# Altium schematic sheet FOC_Drv_1.SchDoc
size A4; SheetNumber: 1; SheetTotal: 1; SPICEModelCacheWCPWHGOG: <root> / <DocumentId>WCPWHGOG</DocumentId> / <CacheFrame Number="0"> / <Model Name="skydiode" Kind="MDL"> / <Text>*Default Schottky Diode / *Schottky Diode Pinout: A,K / .MODEL SKYDIODE D(EG=0.69 XTI=2)</Text> / </Model> / <Model Name="10tq040" Kind="MDL"> / <Text>*10TQ040 MCE 3/26/98 / *Ref: IR Power Semiconductors Product Digest '94 / *MCE 40V 10A 3us pkg:TO-220 3,1 / .MODEL 10TQ040 D (IS=14.2N RS=4.2M N=1.7 BV=40 IBV=15M / + CJO=412P VJ=0.75 M=0.333 TT=4.32U EG=.69 XTI=2)</Text> / </Model> / <Model Name="pnp" Kind="MDL"> / <Text>*Default PNP BJT / *PNP Trans Pinout: C,B,E / .MODEL PNP PNP()</Text> / </Model> / </CacheFrame> / </root>
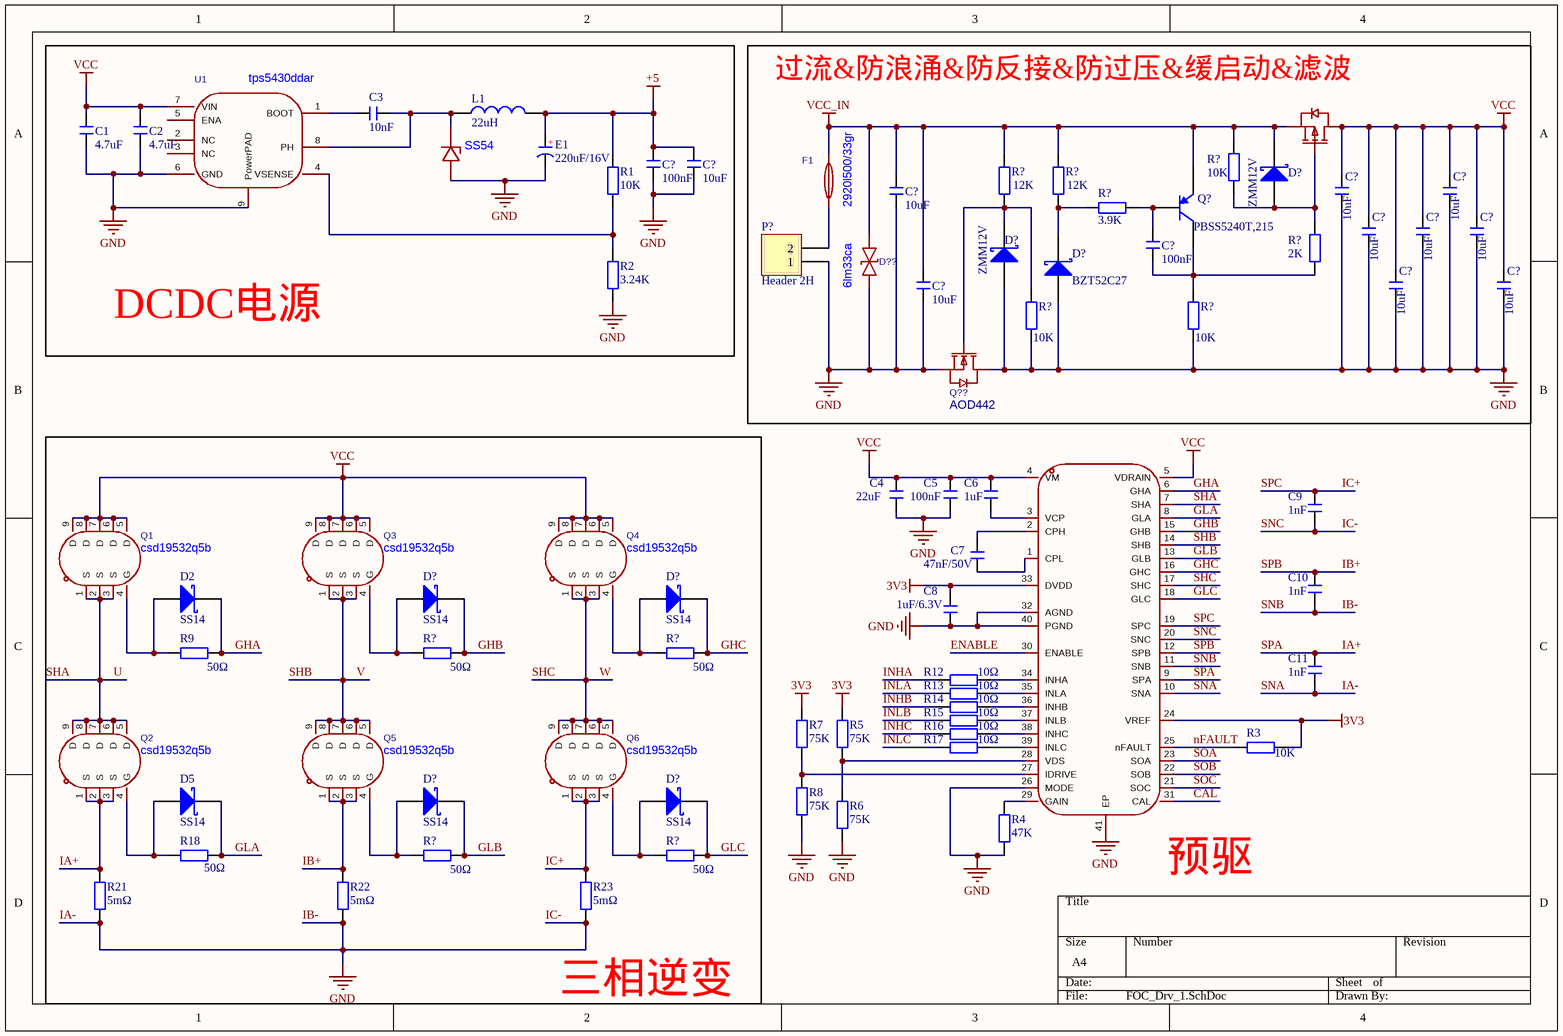
[diagram p0: FOC_Drv_1.SchDoc]

## Parts
(Parts that share a designator on the sheet are numbered #1, #2 ... from top to bottom, then left to right.)
C1  4.7uF  [C 0805]
C2  4.7uF  [C 0805]
C3  10nF  [C 0805]
C4  22uF  [C 0805]
C5  100nF  [C 0805]
C6  1uF  [C 0805]
C7  47nF/50V  [C 0805]
C8  1uF/6.3V  [C 0805]
C9  1nF  [C 0805]
C10  1nF  [C 0805]
C11  1nF  [C 0805]
C?#1  100nF  [C 0805]
C?#2  10uF  [C 0805]
C?#3  10uF  [C 0805]
C?#4  10uF  [C 0805]
C?#5  10uF  [C 0805]
C?#6  10uF  [C 0805]
C?#7  10uF  [C 0805]
C?#8  10uF  [C 0805]
C?#9  100nF  [C 0805]
C?#10  10uF  [C 0805]
C?#11  10uF  [C 0805]
C?#12  10uF  [C 0805]
D1  SS54  [SMA_L4.3-W2.6-LS5.0-FD]
D2  SS14  [SMB]
D5  SS14  [SMB]
D?#1  ZMM12V  [TO-220AC]
D?#2  ZMM12V  [TO-220AC]
D?#3  BZT52C27  [TO-220AC]
D?#4  SS14  [SMB]
D?#5  SS14  [SMB]
D?#6  SS14  [SMB]
D?#7  SS14  [SMB]
D??  6lm33ca  [6LM33CA]
E1  220uF/16V  [CM A(3*5.4)]
F1  2920l500/33gr  [2920l500/33gr]
L1  22uH  [L 0805]
P?  Header 2H  [HDR1X2H]
Q1  csd19532q5b  [SON-8_L5.0-W6.0-P1.27-BL-1]
Q2  csd19532q5b  [SON-8_L5.0-W6.0-P1.27-BL-1]
Q3  csd19532q5b  [SON-8_L5.0-W6.0-P1.27-BL-1]
Q4  csd19532q5b  [SON-8_L5.0-W6.0-P1.27-BL-1]
Q5  csd19532q5b  [SON-8_L5.0-W6.0-P1.27-BL-1]
Q6  csd19532q5b  [SON-8_L5.0-W6.0-P1.27-BL-1]
Q?  PBSS5240T,215  [SOT-23B_N]
Q??#1  sud50p06-15(umw)  [SUD50P06-15]  (value not drawn)
Q??#2  AOD442  [TO-252-3_L6.5-W5.8-P4.58-BL]
R1  10K  [R 0805]
R2  3.24K  [R 0805]
R3  10K  [R 0805]
R4  47K  [R 0805]
R5  75K  [R 0805]
R6  75K  [R 0805]
R7  75K  [R 0805]
R8  75K  [R 0805]
R9  50Ω  [R 0805]
R12  10Ω  [R 0805]
R13  10Ω  [R 0805]
R14  10Ω  [R 0805]
R15  10Ω  [R 0805]
R16  10Ω  [R 0805]
R17  10Ω  [R 0805]
R18  50Ω  [R 0805]
R21  5mΩ  [R 0805]
R22  5mΩ  [R 0805]
R23  5mΩ  [R 0805]
R?#1  10K  [R 0805]
R?#2  12K  [R 0805]
R?#3  12K  [R 0805]
R?#4  3.9K  [R 0805]
R?#5  2K  [R 0805]
R?#6  10K  [R 0805]
R?#7  10K  [R 0805]
R?#8  50Ω  [R 0805]
R?#9  50Ω  [R 0805]
R?#10  50Ω  [R 0805]
R?#11  50Ω  [R 0805]
U1  tps5430ddar  [TPS5430]
U2  drv8323hrtar  [QFN-40_L6.0-W6.0-P0.50-BL-EP4.5]  (value not drawn)

## Blocks framed on the sheet
DCDC电源: C1-C3 C?#1 C?#2 D1 E1 L1 R1 R2 U1
过流&防浪涌&防反接&防过压&缓启动&滤波: C?#3-C?#12 D?#1-D?#3 D?? F1 P? Q? Q??#1 Q??#2 R?#1-R?#7
三相逆变: D2 D5 D?#4-D?#7 Q1-Q6 R9 R18 R21-R23 R?#8-R?#11

## Nets
3V3: C8.1 R3.1 R5.1 R7.1 U2.24(VREF) U2.33(DVDD)
+5: C?#1.1 C?#2.1 E1.1(A) L1.2 R1.2
IA-: C1.2 C2.2 C4.1 C5.1 C8.2 C9.1 C10.1 C11.1 C?#1.2 C?#2.2 C?#3.2 C?#4.2 C?#5.2 C?#6.2 C?#7.2 C?#8.2 C?#10.2 C?#11.2 C?#12.2 D1.1(A) D?#2.3(A) D?#3.3(A) D??.1 E1.2(K) P?.1 Q??#2.2(D) Q??#2.3(S) R2.1 R4.2 R6.2 R8.2 R21.2 R22.2 R23.2 R?#6.1 R?#7.1 U1.6(GND) U1.9(PowerPAD) U2.10(SNA) U2.11(SNB) U2.20(SNC) U2.26(MODE) U2.32(AGND) U2.40(PGND) U2.41(EP)  [also labelled GND, IB-, IC-, SNA, SNB, SNC]
VCC: C1.1 C2.1 C4.2 C5.2 C6.2 C?#4.1 C?#5.1 C?#6.1 C?#7.1 C?#8.1 C?#11.1 C?#12.1 Q1.5(D) Q1.6(D) Q1.7(D) Q1.8(D) Q1.9(D) Q3.5(D) Q3.6(D) Q3.7(D) Q3.8(D) Q3.9(D) Q4.5(D) Q4.6(D) Q4.7(D) Q4.8(D) Q4.9(D) Q??#1.2(D) U1.7(VIN) U2.4(VM) U2.5(VDRAIN)
VCC_IN: C?#3.1 C?#10.1 D?#1.1(K) D??.2 F1.2 Q?.3(E) Q??#1.3(S) R?#1.2 R?#2.2 R?#3.2
CAL: U2.31(CAL)
ENABLE: U2.30(ENABLE)
GHA: D2.2(K) R9.1 U2.6(GHA)
GHB: D?#4.2(K) R?#8.1 U2.15(GHB)
GHC: D?#5.2(K) R?#9.1 U2.16(GHC)
GLA: D5.2(K) R18.1 U2.8(GLA)
GLB: D?#6.2(K) R?#10.1 U2.13(GLB)
GLC: D?#7.2(K) R?#11.1 U2.18(GLC)
IA+: C11.2 Q2.1(S) Q2.2(S) Q2.3(S) R21.1 U2.9(SPA)  [also labelled SPA]
IB+: C10.2 Q5.1(S) Q5.2(S) Q5.3(S) R22.1 U2.12(SPB)  [also labelled SPB]
IC+: C9.2 Q6.1(S) Q6.2(S) Q6.3(S) R23.1 U2.19(SPC)  [also labelled SPC]
INHA: R12.2
INHB: R14.2
INHC: R16.2
INLA: R13.2
INLB: R15.2
INLC: R17.2
nFAULT: R3.2 U2.25(nFAULT)
SHA: Q1.1(S) Q1.2(S) Q1.3(S) Q2.5(D) Q2.6(D) Q2.7(D) Q2.8(D) Q2.9(D) U2.7(SHA)  [also labelled U]
SHB: Q3.1(S) Q3.2(S) Q3.3(S) Q5.5(D) Q5.6(D) Q5.7(D) Q5.8(D) Q5.9(D) U2.14(SHB)  [also labelled V]
SHC: Q4.1(S) Q4.2(S) Q4.3(S) Q6.5(D) Q6.6(D) Q6.7(D) Q6.8(D) Q6.9(D) U2.17(SHC)  [also labelled W]
SOA: U2.23(SOA)
SOB: U2.22(SOB)
SOC: U2.21(SOC)
NetC3_1: C3.1 D1.2(K) L1.1 U1.8(PH)
NetC3_2: C3.2 U1.1(BOOT)
NetC6_1: C6.1 U2.3(VCP)
NetC7_1: C7.1 U2.2(CPH)
NetC7_2: C7.2 U2.1(CPL)
NetC?#9_1: C?#9.1 Q?.2(B) R?#4.1
NetC?#9_2: C?#9.2 Q?.1(C) R?#5.1 R?#7.2
NetD2_1: D2.1(A) Q1.4(G) R9.2
NetD5_1: D5.1(A) Q2.4(G) R18.2
NetD?#1_3: D?#1.3(A) Q??#1.1(G) R?#1.1 R?#5.2
NetD?#2_1: D?#2.1(K) Q??#2.1(G) R?#2.1 R?#6.2
NetD?#3_1: D?#3.1(K) R?#3.1 R?#4.2
NetD?#4_1: D?#4.1(A) Q3.4(G) R?#8.2
NetD?#5_1: D?#5.1(A) Q4.4(G) R?#9.2
NetD?#6_1: D?#6.1(A) Q5.4(G) R?#10.2
NetD?#7_1: D?#7.1(A) Q6.4(G) R?#11.2
NetF1_1: F1.1 P?.2
NetR1_1: R1.1 R2.2 U1.4(VSENSE)
NetR4_1: R4.1 U2.29(GAIN)
NetR5_2: R5.2 R6.1 U2.28(VDS)
NetR7_2: R7.2 R8.1 U2.27(IDRIVE)
NetR12_1: R12.1 U2.34(INHA)
NetR13_1: R13.1 U2.35(INLA)
NetR14_1: R14.1 U2.36(INHB)
NetR15_1: R15.1 U2.37(INLB)
NetR16_1: R16.1 U2.38(INHC)
NetR17_1: R17.1 U2.39(INLC)

Not connected (* = marked no-connect by the designer): U1 2(NC) 3(NC) 5(ENA)

## Notes on the sheet
- (near U2) 预驱
- (in symbol C-CM) +

## Library data of the parts
C1-C11 C?#1-C?#12 = C: 无极性贴片电容; 版权归属: 源创客; BOM名称: 无极性贴片电容; 学习资源: www.ooocke.com
D1 = ss54_c7420369: 二极管配置:独立式;正向压降(Vf):550mV@5A;直流反向耐压(Vr):40V;整流电流:5A;; Manufacturer: R+O(宏嘉诚); AddInBom: yes; ModelId: 7e24bebe6cd74171ae8c9de6fc5b78aa; ModelTransform: 198.4248,103.5431,0,180,0,0,-0.001,0,0; Diode Configuration: 独立式; Voltage - DC Reverse(Vr): 40V; Current - Rectified: 5A; Reverse Leakage Current (Ir): 50uA@40V; Operating Junction Temperature Range: -55℃~+125℃; Non-Repetitive Peak Forward Surge Current: 120A; Symbol: SS54_C7420369; LCSC Part Name: 电压:40V 电流:5A; SupplierPart: C7420369; ManufacturerPart: SS54; Supplier Footprint: SMA(DO-214AC); JLCPCB Part Class: Extended Part; Datasheet: https://item.szlcsc.com/datasheet/SS54/8397191.html; Supplier: LCSC; ConvertToPcb: yes; FootprintName: SMA_L4.3-W2.6-LS5.0-FD; ModelName: SMA_L4.3-W2.6-LS5.0-FD; Voltage - Forward(Vf@If): 550mV@5A
D2 D5 D?#4-D?#7 = D Schottky: Schottky Diode; Published: 8-Jun-2000; LatestRevisionDate: 17-Jul-2002; LatestRevisionNote: Re-released for DXP Platform.; PackageReference: SMB; Publisher: Altium Limited; PackageDescription: DO-214-AA/SMB; 2 C-Bend Leads; Body 5.3 x 3.6 mm, inc. leads (LxW); Code_JEDEC: DO-214-AA
D?#1-D?#3 = Diode 10TQ040: Schottky Rectifier; Note: Terminal 2 is the TAB and is electrically connected to the cathode; Published: 8-Jun-2000; LatestRevisionDate: 17-Jul-2002; LatestRevisionNote: Re-released for DXP Platform.; DatasheetVersion: PD-2.057B; PackageVersion: Feb-1998; PackageReference: TO-220AC; Publisher: Altium Limited; PackageDescription: TO, Thru-Hole, Vertical, Heatsink Mounted; 3 In-Line Leads (1 Absent); Pitch 2.54 mm; ComponentLink1Description: Manufacturer Link; ComponentLink1URL: http://www.irf.com/
D?? = 6lm33ca: Manufacturer: Leiditech(雷卯电子); AddInBom: yes; ModelId: 5cfb9fa8428548fca5ac9f51208ec219; ModelName: SMBF_L4.3-W3.6-LS5.3-BI; ModelTransform: 210.63,142.5194,0,0,0,0,0,0,0; Symbol: 6LM33CA; LCSC Part Name: 低Vc瞬态电压抑制器，适用于多种应用，具有玻璃钝化或平面结、出色钳位能力等特性; SupplierPart: C53114808; ManufacturerPart: 6LM33CA; Supplier Footprint: SMB(DO-214AA); JLCPCB Part Class: Extended Part; Datasheet: https://item.szlcsc.com/datasheet/6LM33CA/56092828.html; Supplier: LCSC; ConvertToPcb: yes; FootprintName: SMBF_L4.3-W3.6-LS5.3-BI
E1 = C-CM: 贴片电解电容; 版权归属: 源创客; BOM名称: 贴片电解电容; 学习资源: www.ooocke.com
F1 = 2920l500/33gr: 耐压(Vmax):33V;最大电流(Imax):40A;保持电流(Ihold):5A;跳闸电流(Itrip):10A;; Manufacturer: LUTE(陆特); AddInBom: yes; ModelId: c20979b6eed84fe694c25fdbe1326c05; ModelName: F2920-1; ModelTransform: 289.7632,201.5744,0,0,0,0,0,0,0; Voltage - Max: 33V; Current - Max: 40A; Hold Current: 5A; Trip Current: 10A; Power Dissipation: 2.5W; Resistance - Initial (Ri) (Min): 5mΩ; Resistance - Post Trip (R1) (Max): 31mΩ; Time to Trip(Max): 5s; Symbol: 2920L500/33GR; LCSC Part Name: 33V 5.00A 2920 自恢复; SupplierPart: C48985881; ManufacturerPart: 2920L500/33GR; Supplier Footprint: 2920; JLCPCB Part Class: Extended Part; Datasheet: https://item.szlcsc.com/datasheet/2920L500%252F33GR/51318605.html; Supplier: LCSC; ConvertToPcb: yes; FootprintName: F2920; Operating Temperature: -40℃~+85℃
L1 = L: 小功率贴片电感; 版权归属: 源创客; BOM名称: 小功率贴片电感; 学习资源: www.ooocke.com
P? = Header 2H: Header, 2-Pin, Right Angle; LatestRevisionDate: 17-Jul-2002; LatestRevisionNote: Re-released for DXP Platform.; Publisher: Altium Limited
Q1-Q6 = csd19532q5b: 数量:-;漏源电压(Vdss):100V;连续漏极电流(Id):100A;导通电阻(RDS(on)):4.6mΩ@6V,17A;耗散功率(Pd):195W;阈值电压(Vgs(th)):2.6V;; Manufacturer: TI(德州仪器); AddInBom: yes; ModelId: 37244444be64495d8a7e9078c2813e17; ModelTransform: 204.724,240.157,0,0,0,0,0,1.968,0; Drain to Source Voltage: 100V; Current - Continuous Drain(Id): 100A; Pd - Power Dissipation: 195W; Gate Threshold Voltage (Vgs(th)): 2.6V; Gate Charge(Qg): 48nC@10V; Input Capacitance(Ciss): 4.81nF@50V; Reverse Transfer Capacitance (Crss@Vds): 18pF@50V; Type: N沟道; Output Capacitance(Coss): 706pF; Symbol: CSD19532Q5B; LCSC Part Name: 耐压:100V 电流:100A; SupplierPart: C473333; ManufacturerPart: CSD19532Q5B; Supplier Footprint: SON-8(5x6); JLCPCB Part Class: Extended Part; Datasheet: https://www.ti.com/cn/lit/gpn/csd19532q5b; Supplier: LCSC; ConvertToPcb: yes; FootprintName: SON-8_L5.0-W6.0-P1.27-BL-1; ModelName: SON-8_L5.0-W6.0-P1.27-BL-1; Number: -; RDS(on): 4.6mΩ@6V,17A; Operating Temperature: -55℃~+150℃; Configuration: -
Q? = PNP: PNP Bipolar Transistor; Published: 8-Jun-2000; LatestRevisionDate: 29-May-2009; LatestRevisionNote: IPC-7351 Footprint Added.; PackageVersion: Aug-1999; PackageReference: SOT-23B; Publisher: Altium Limited; PackageDescription: 3-Pin SOT-23 Package 0.95 mm Pitch, 2.4 mm Lead Span
Q??#1 = sud50p06-15(umw): 漏源电压(Vdss):60V;连续漏极电流(Id):50A;导通电阻(RDS(on)):12mΩ@10V;耗散功率(Pd):2.5W;阈值电压(Vgs(th)):1.8V@250uA;; Manufacturer: UMW(友台半导体); AddInBom: yes; ModelId: ce57f84d66384067af8a68020b6de06d; ModelName: TO-252-2L-3P_L6.6-W6.1-H2.3-LS10.1-P4.6; ModelTransform: 259.842,390.52442,0,270,0,0,39.372,0.002,0; Drain to Source Voltage: 60V; Current - Continuous Drain(Id): 50A; Pd - Power Dissipation: 2.5W; Gate Charge(Qg): 110nC@10V; Input Capacitance(Ciss): 4.95nF@25V; Reverse Transfer Capacitance (Crss@Vds): 405pF@25V; Type: P沟道; Symbol: SUD50P06-15(UMW); LCSC Part Name: P沟道 耐压:60V 电流:50A; SupplierPart: C7503186; ManufacturerPart: SUD50P06-15(UMW); Supplier Footprint: TO-252; JLCPCB Part Class: Extended Part; Datasheet: https://item.szlcsc.com/datasheet/SUD50P06-15(UMW)/8592057.html; Supplier: LCSC; ConvertToPcb: yes; FootprintName: TO-252-2_L6.6-W6.1-P4.58-LS9.9-TL; RDS(on): 12mΩ@10V; Gate Threshold Voltage (Vgs(th)): 1.8V@250uA; Operating Temperature: -55℃~+150℃
Q??#2 = aod442: 数量:1个N沟道;漏源电压(Vdss):60V;连续漏极电流(Id):37A;导通电阻(RDS(on)):25mΩ@4.5V,20A;耗散功率(Pd):60W;阈值电压(Vgs(th)):2.7V;; Manufacturer: AOS; AddInBom: yes; ModelId: b30bfce30d0f4a429b5e4d5ada8cad65; ModelTransform: 249.9995,380.57715,0,0,0,0,0,38.779,0; Number: 1个N沟道; Drain to Source Voltage: 60V; Current - Continuous Drain(Id): 37A; Pd - Power Dissipation: 60W; Gate Threshold Voltage (Vgs(th)): 2.7V; Gate Charge(Qg): 68nC@10V; Input Capacitance(Ciss): 2.3nF@30V; Reverse Transfer Capacitance (Crss@Vds): 165pF@30V; Symbol: AOD442; LCSC Part Name: 1个N沟道 耐压:60V 电流:37A; SupplierPart: C87617; ManufacturerPart: AOD442; Supplier Footprint: TO-252-2(DPAK); JLCPCB Part Class: Extended Part; Datasheet: https://item.szlcsc.com/datasheet/AOD442/88795.html; Supplier: LCSC; ConvertToPcb: yes; FootprintName: TO-252-3_L6.5-W5.8-P4.58-BL; ModelName: TO-252-3_L6.5-W5.8-P4.58-BL; RDS(on): 25mΩ@4.5V,20A; Operating Temperature: -55℃~+175℃
R1-R9 R12-R18 R21-R23 R?#1-R?#11 = R: 贴片电阻; 版权归属: 源创客; BOM名称: 贴片电阻; 学习资源: www.ooocke.com
U1 = tps5430ddar: 功能类型:降压型;工作电压:5.5V~36V;输出电压:1.221V~32.04V;输出电流:3A;输出类型:可调;; Manufacturer: TI(德州仪器); AddInBom: yes; ModelId: 821ddb58f3244ffb9a5d6f8174c5b14e; ModelName: ESOP-8_L4.9-W3.9-P1.27-LS6.0-TL-EP; ModelTransform: 236.22,192.913,0,0,0,0,0,0,0; Function: 降压型; Output Current: 3A; Frequency - Switching: 500kHz; Synchronous Rectifier: 否; Number of Outputs: 1; Topology: 降压式; Quiescent Current: 4.4mA; Switch tube (built-in/external): 内置; Output Type: 可调; Symbol: TPS5430DDAR; LCSC Part Name: 降压型 3A 5.5V~36V; SupplierPart: C9864; ManufacturerPart: TPS5430DDAR; Supplier Footprint: SOIC-8-EP; JLCPCB Part Class: Basic Part; Datasheet: https://www.ti.com/cn/lit/ds/symlink/tps5430.pdf; Supplier: LCSC; ConvertToPcb: yes; FootprintName: ESOP-8_L4.9-W3.9-P1.27-LS6.0-TL-EP; Voltage - Supply: 5.5V~36V; Output Voltage: 1.221V~32.04V; Operating Temperature: -40℃~+125℃@(TJ); Features: 逐波限流；过流保护；打嗝限流
U2 = drv8323hrtar: DRV8323 具有电流分流放大器的最大 65V 三相智能栅极驱动器; Manufacturer: TI(德州仪器); AddInBom: yes; ModelId: 462395c9b4394dd8ac3680d491deb075; ModelName: QFN-40_L6.0-W6.0-H0.8-P0.50; ModelTransform: 237.007,237.007,0,90,0,0,-0.003,0.003,0; Drive Type: 三相; Integrated FETs: 否; Number of Half Bridges: 3; Quiescent Current(Iq): 12uA; Interface: SPI; Symbol: DRV8323HRTAR; LCSC Part Name: 5mA 无刷直流BLDC电机驱动芯片 60V; SupplierPart: C701783; ManufacturerPart: DRV8323HRTAR; Supplier Footprint: WQFN-40-EP(6x6); JLCPCB Part Class: Extended Part; Datasheet: https://www.ti.com/cn/lit/gpn/drv8323; Supplier: LCSC; ConvertToPcb: yes; FootprintName: QFN-40_L6.0-W6.0-P0.50-BL-EP4.5; Output Current: -; Peak Current: -; Voltage - Supply: -; RDS(on): -; Operating Temperature: -40℃~+125℃